# Altium project Keyboard_IDC_I2C.PrjPcb
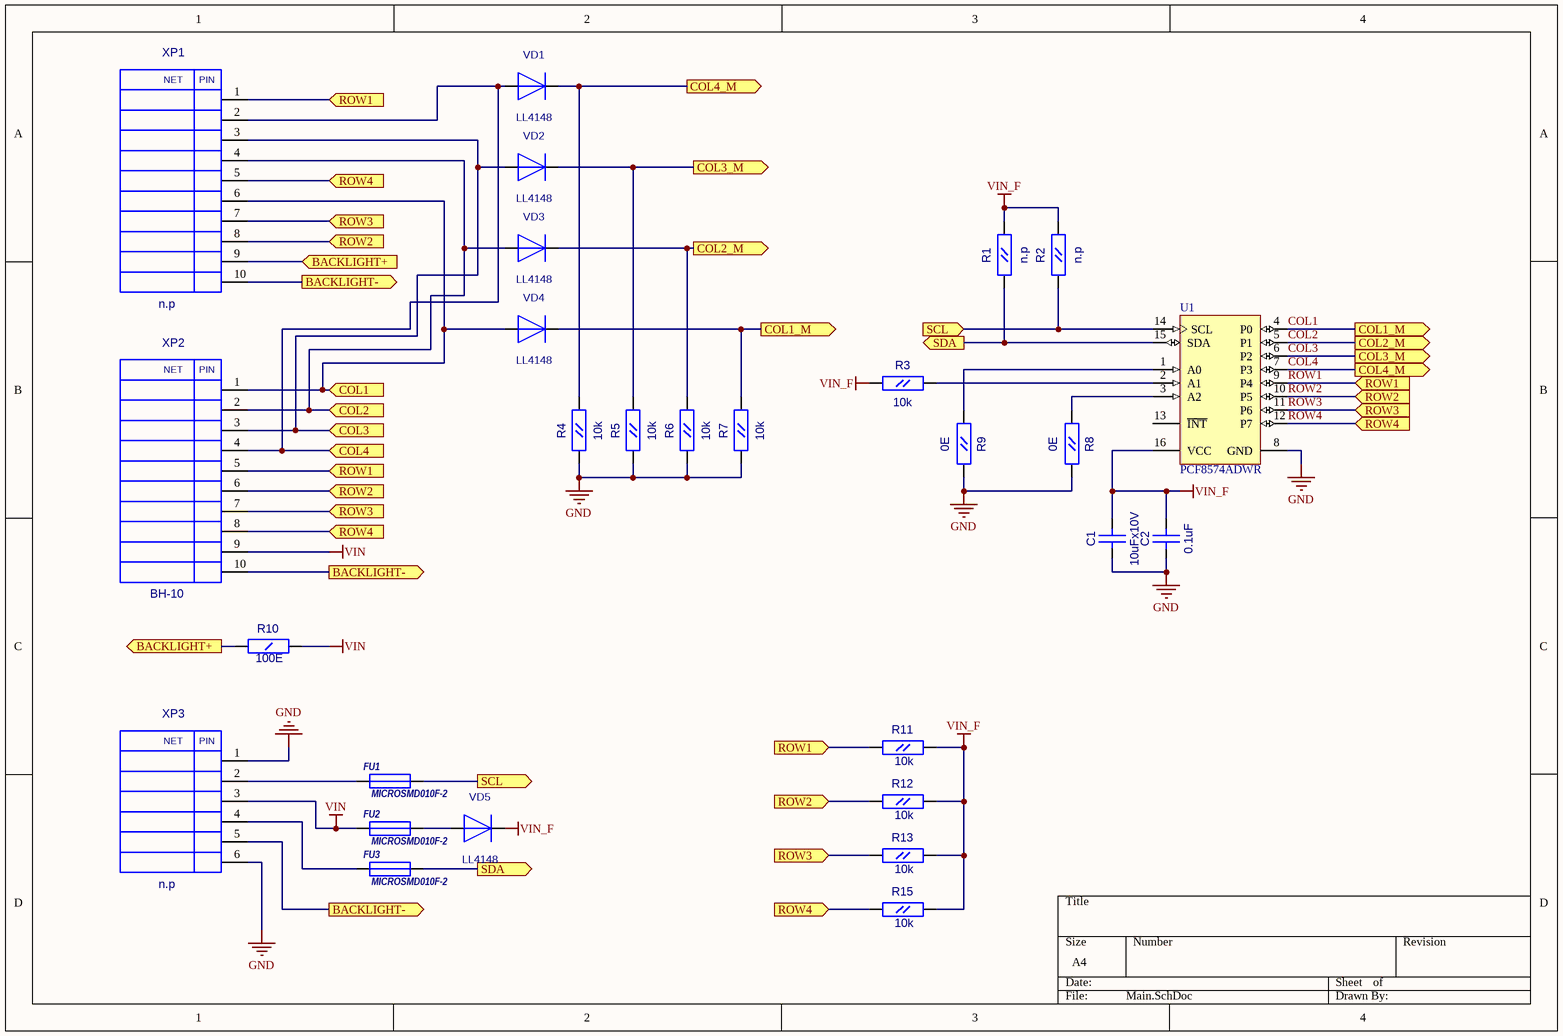
[diagram p0: Main.SchDoc]
1 sheet, 28 parts. Net scope: flat (ports and power ports of the same name join across sheets).
Board file: Keyboard_IDC_I2C.PcbDoc

## Sheet Main.SchDoc
size A4

### Parts
C1  10uFx10V  [CC0805]
C2  0.1uF  [CC0603]
FU1  MICROSMD010F-2  [RC1210]
FU2  MICROSMD010F-2  [RC1210]
FU3  MICROSMD010F-2  [RC1210]
R1  n.p  [RC0603]
R2  n.p  [RC0603]
R3  10k  [RC0603]
R4  10k  [RC0603]
R5  10k  [RC0603]
R6  10k  [RC0603]
R7  10k  [RC0603]
R8  0E  [RC0603]
R9  0E  [RC0603]
R10  100E  [RC1206]
R11  10k  [RC0603]
R12  10k  [RC0603]
R13  10k  [RC0603]
R15  10k  [RC0603]
U1  PCF8574ADWR  [DW16_N]
VD1  LL4148  [SOD-80]
VD2  LL4148  [SOD-80]
VD3  LL4148  [SOD-80]
VD4  LL4148  [SOD-80]
VD5  LL4148  [SOD-80]
XP1  n.p  [PLS-10]
XP2  BH-10  [BH-10]
XP3  n.p  [MIF2X03PRP]

### Ports
BACKLIGHT+ (in), BACKLIGHT+ (out), BACKLIGHT- (out), COL1 (in), COL1_M (out), COL2 (in), COL2_M (out), COL3 (in), COL3_M (out), COL4 (in), COL4_M (out), ROW1 (in), ROW2 (in), ROW3 (in), ROW4 (in), SCL (in), SCL (out), SDA (out)

### Nets
GND: C1.1(A) C2.1(A) R4.1(A) R5.1(A) R6.1(A) R7.1(A) R8.2(B) R9.2(B) U1.8(GND) XP3.1 XP3.6
VIN: FU2.1 R10.2(B) XP2.9 XP3.3
VIN_F: C1.2(B) C2.2(B) R1.2(B) R2.2(B) R3.1(A) R11.2(B) R12.2(B) R13.2(B) R15.2(B) U1.16(VCC) VD5.2(+)
COL1: R7.2(B) U1.4(P0) VD4.2(+) ; port COL1_M
COL2: R6.2(B) U1.5(P1) VD3.2(+) ; port COL2_M
COL3: R5.2(B) U1.6(P2) VD2.2(+) ; port COL3_M
COL4: R4.2(B) U1.7(P3) VD1.2(+) ; port COL4_M
ROW1: R11.1(A) U1.9(P4) XP1.1 XP2.5 ; port ROW1
ROW2: R12.1(A) U1.10(P5) XP1.8 XP2.6 ; port ROW2
ROW3: R13.1(A) U1.11(P6) XP1.7 XP2.7 ; port ROW3
ROW4: R15.1(A) U1.12(P7) XP1.5 XP2.8 ; port ROW4
NetFU1_1: FU1.1 XP3.2
NetFU1_2: FU1.2 R2.1(A) U1.14(SCL) ; port SCL
NetFU2_2: FU2.2 VD5.1(-)
NetFU3_1: FU3.1 XP3.4
NetFU3_2: FU3.2 R1.1(A) U1.15(SDA) ; port SDA
NetR3_2: R3.2(B) U1.2(A1)
NetR8_1: R8.1(A) U1.3(A2)
NetR9_1: R9.1(A) U1.1(A0)
NetR10_1: R10.1(A) XP1.9 ; port BACKLIGHT+
NetVD1_1: VD1.1(-) XP1.2 XP2.4 ; port COL4
NetVD2_1: VD2.1(-) XP1.3 XP2.3 ; port COL3
NetVD3_1: VD3.1(-) XP1.4 XP2.2 ; port COL2
NetVD4_1: VD4.1(-) XP1.6 XP2.1 ; port COL1
NetXP1_10: XP1.10 XP2.10 XP3.5 ; port BACKLIGHT-

Not connected (* = marked no-connect by the designer): U1 13(~{INT})

### Notes on the sheet
- (in symbol BH-10) NET; PIN
- (in symbol MIF2X03PRP) NET; PIN
- (in symbol PLS-10) NET; PIN

### Library data of the parts
C1 = CC0805: Value: 10uFx10V
C2 = CC0603: Value: 0.1uF
FU1-FU3 = MICROSMD: Value: MICROSMD010F-2
R1-R9 R11-R13 R15 = RC0603
  R1 R2: Value: n.p
  R3-R7 R11-R13 R15: Value: 10k
  R8 R9: Value: 0E
R10 = RC1206: Value: 100E
U1 = PCF8574ADWR: Remote 8-Bit I/O Expander for I2C-Bus, 2.5 to 6.0 V, -40 to 85 degC, 16-pin SOIC (DW), Green (RoHS & no Sb/Br); Manufacturer: Texas Instruments; SubFamily: I2C IO Expander; Voltage Nodes(V): 5, 3.3; Interrupt Output: Yes; fSCLK(Max)(MHz): 0.1; VCC(Min)(V): 2.5; VCC(Max)(V): 6; Max Frequency(kHz): 100; I2C Address: 0111 xxx; # of I/Os: 8; DatasheetVersion: SCPS069D; PackageVersion: revG, Jan-2011; PackageReference: DW16; PackageDescription: 16-Pin Small Outline Integrated Circuit, 10.3 x 7.5 mm, Pitch 1.27 mm Pitch; Supplier 1: Digi-Key; Supplier Part Number 1: 296-13105-2-ND; Supplier 2: Digi-Key; Supplier Part Number 2: 296-13105-1-ND; Supplier 3: Digi-Key; Supplier Part Number 3: 296-13105-6-ND; Supplier 4: Newark; Supplier Part Number 4: 75C5233; Supplier 5: Mouser; Supplier Part Number 5: 595-PCF8574ADWR; Eco-Plan: Green (RoHS & no Sb/Br); Reset Input: No; Vcc range(V): 2.5 to 6.0; Push-Pull I/O Type: Yes; Mounting Technology: Surface Mount; PartNumber: PCF8574ADWR; Code_JEDEC: MS-013-AA; ComponentLink1Description: Datasheet; ComponentLink1URL: http://www.ti.com/general/docs/lit/getliterature.tsp?genericPartNumber=PCF8574A&fileType=pdf; ComponentLink2Description: Package Specification; ComponentLink2URL: http://www.ti.com/litv/pdf/msoi003g
XP1 = PLS-10: Value: *
XP3 = MIF2X03PRP: Value: n.p
VD1-VD5 = LL4148: Value: *
XP2 = BH-10: Value: *